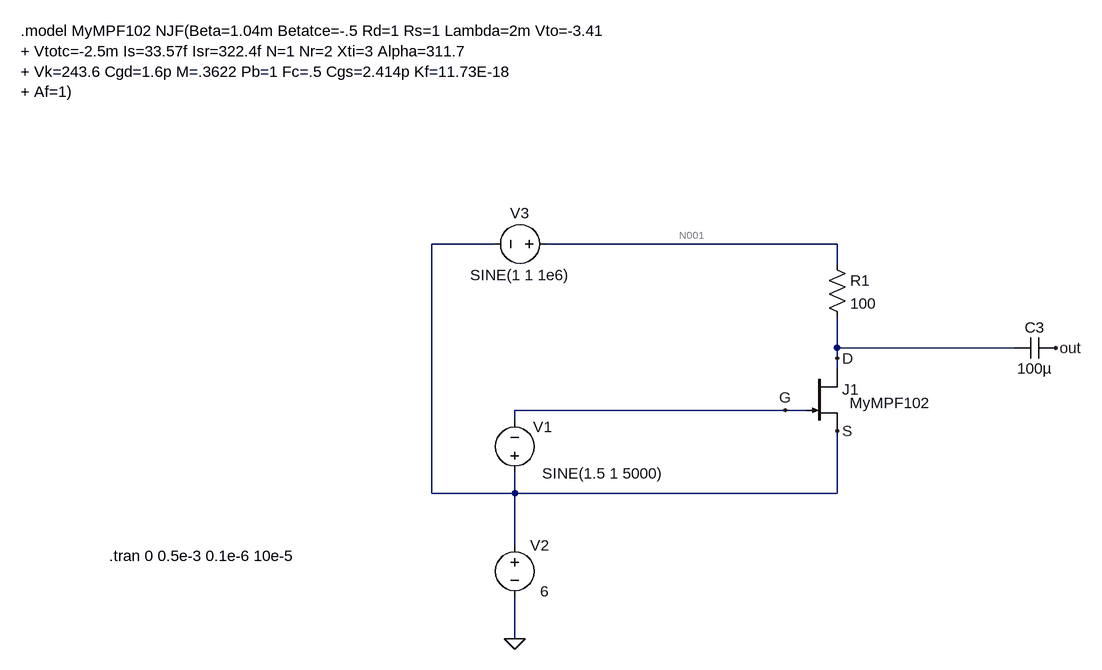
[diagram p0: schematic Fourth_JFET_AM_no_divider.asc]
Fourth_JFET_AM_no_divider.asc, the LTspice schematic file:
Version 4
SHEET 1 1424 680
WIRE -288 -64 -384 -64
WIRE 240 -64 -208 -64
WIRE 240 -32 240 -64
WIRE 240 96 240 48
WIRE 512 96 240 96
WIRE 240 112 240 96
WIRE 240 128 240 112
WIRE 160 192 -256 192
WIRE 192 192 160 192
WIRE -256 208 -256 192
WIRE -384 320 -384 -64
WIRE -256 320 -256 288
WIRE -256 320 -384 320
WIRE 240 320 240 224
WIRE 240 320 -256 320
WIRE -256 400 -256 320
WIRE -256 544 -256 480
FLAG 160 192 G
FLAG 240 112 D
FLAG 240 224 S
FLAG 576 96 out
FLAG -256 544 0
SYMBOL njf 192 128 R0
WINDOW 3 67 53 Left 2
SYMATTR Value MyMPF102
SYMATTR InstName J1
SYMBOL voltage -256 304 R180
WINDOW 123 24 124 Left 2
WINDOW 39 0 0 Left 0
WINDOW 0 -58 86 Left 2
WINDOW 3 -229 15 Left 2
SYMATTR InstName V1
SYMATTR Value SINE(1.5 1 5000)
SYMBOL cap 576 80 R90
WINDOW 0 0 32 VBottom 2
WINDOW 3 32 32 VTop 2
SYMATTR InstName C3
SYMATTR Value 100µ
SYMBOL voltage -192 -64 R90
WINDOW 0 -32 56 VBottom 2
WINDOW 3 32 56 VTop 2
WINDOW 123 0 0 Left 0
WINDOW 39 0 0 Left 0
SYMATTR InstName V3
SYMATTR Value SINE(1 1 1e6)
SYMBOL voltage -256 384 R0
WINDOW 3 39 87 Left 2
WINDOW 123 0 0 Left 0
WINDOW 39 0 0 Left 0
SYMATTR InstName V2
SYMATTR Value 6
SYMBOL res 224 -48 R0
SYMATTR InstName R1
SYMATTR Value 100
TEXT -1016 -392 Left 2 !.model MyMPF102 NJF(Beta=1.04m Betatce=-.5 Rd=1 Rs=1 Lambda=2m Vto=-3.41\n+ Vtotc=-2.5m Is=33.57f Isr=322.4f N=1 Nr=2 Xti=3 Alpha=311.7\n+ Vk=243.6 Cgd=1.6p M=.3622 Pb=1 Fc=.5 Cgs=2.414p Kf=11.73E-18\n+ Af=1)
TEXT -880 416 Left 2 !.tran 0 0.5e-3 0.1e-6 10e-5

The netlist it stands for:
* Fourth_JFET_AM_no_divider.asc
J1 D G S MyMPF102
V1 S G SINE(1.5 1 5000)
C3 out D 100µ
V3 N001 S SINE(1 1 1e6)
V2 S 0 6
R1 N001 D 100
.model NJF NJF
.model PJF PJF
.lib standard.jft
.model MyMPF102 NJF(Beta=1.04m Betatce=-.5 Rd=1 Rs=1 Lambda=2m Vto=-3.41
+ Vtotc=-2.5m Is=33.57f Isr=322.4f N=1 Nr=2 Xti=3 Alpha=311.7
+ Vk=243.6 Cgd=1.6p M=.3622 Pb=1 Fc=.5 Cgs=2.414p Kf=11.73E-18
+ Af=1)
.tran 0 0.5e-3 0.1e-6 10e-5
.backanno
.end

* Results of the author's LTspice run, read from the files saved beside the schematic
* Operating Point, zero values left out:
*   V(d) = 6.759 V
*   V(g) = 4.5 V
*   V(s) = 6 V
*   V(out) = 675.9 µV
*   V(n001) = 7 V
*   Id(J1) = 2.406 mA
*   Ig(J1) = -4.771 pA
*   Is(J1) = -2.406 mA
*   I(R1) = 2.406 mA
*   I(V3) = -2.406 mA
*   I(V1) = -4.771 pA
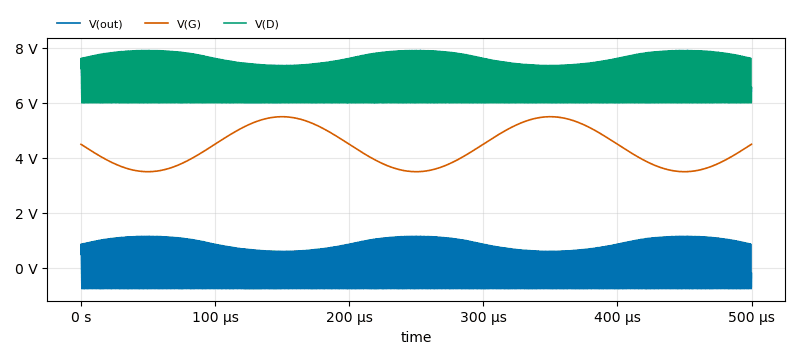
[diagram p1: Transient Analysis of Fourth_JFET_AM_no_divider.asc, plotted from the saved traces]
* Transient Analysis, 1 run:
*   V(out): min -758.7 mV, max 1.154 V, average 57.26 mV, rms 606.8 mV, last 263.3 µV
*   V(G): min 3.5 V, max 5.5 V, average 4.373 V, rms 4.428 V, last 4.5 V
*   V(D): min 6 V, max 7.913 V, average 6.816 V, rms 6.843 V, last 6.759 V